# EAGLE design 40106PWM (EAGLE 6.3)
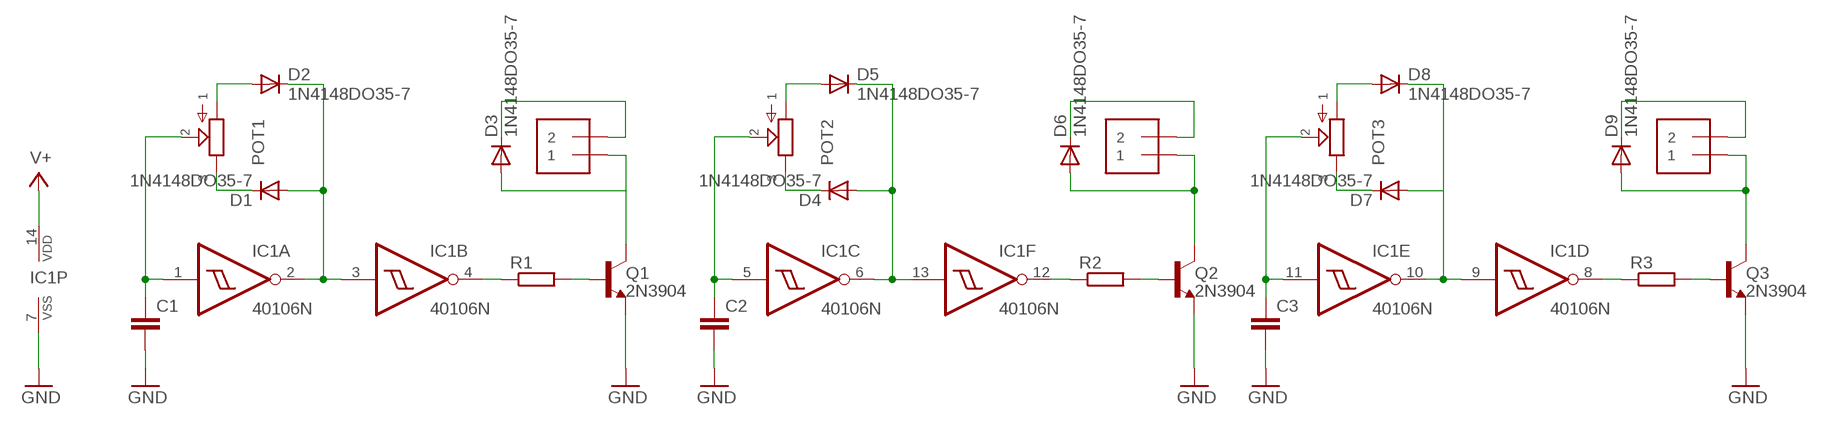
[diagram p0: schematic, sheet 1]

## Parts
C1  C-EU050-025X075  [C050-025X075]
C2  C-EU050-025X075  [C050-025X075]
C3  C-EU050-025X075  [C050-025X075]
D1  1N4148DO35-7  [DO35-7]
D2  1N4148DO35-7  [DO35-7]
D3  1N4148DO35-7  [DO35-7]
D4  1N4148DO35-7  [DO35-7]
D5  1N4148DO35-7  [DO35-7]
D6  1N4148DO35-7  [DO35-7]
D7  1N4148DO35-7  [DO35-7]
D8  1N4148DO35-7  [DO35-7]
D9  1N4148DO35-7  [DO35-7]
IC1  40106N  [DIL14]
J1  1X2-3.5MM  [1X2-3.5MM]
J2  1X2-3.5MM  [1X2-3.5MM]
J3  1X2-3.5MM  [1X2-3.5MM]
POT1  POT-EU16MM  [16MM]
POT2  POT-EU16MM  [16MM]
POT3  POT-EU16MM  [16MM]
Q1  2N3904  [TO92-]
Q2  2N3904  [TO92-]
Q3  2N3904  [TO92-]
R1  R-EU_0207/10  [0207/10]
R2  R-EU_0207/10  [0207/10]
R3  R-EU_0207/10  [0207/10]

## Nets
GND: C1.2 C2.2 C3.2 IC1.7(P:VSS) Q1.3(E) Q2.3(E) Q3.3(E)
N$1: D1.A D2.C IC1.2(A:O) IC1.3(B:I)
N$2: D4.A D5.C IC1.6(C:O) IC1.13(F:I)
N$3: D7.A D8.C IC1.9(D:I) IC1.10(E:O)
N$4: D2.A POT1.1
N$5: C3.1 IC1.11(E:I) POT3.2
N$6: C1.1 IC1.1(A:I) POT1.2
N$7: C2.1 IC1.5(C:I) POT2.2
N$8: D1.C POT1.3
N$9: IC1.4(B:O) R1.1
N$10: Q1.2(B) R1.2
N$11: D3.A J1.1 Q1.1(C)
N$12: D3.C J1.2
N$15: D5.A POT2.1
N$16: D4.C POT2.3
N$17: IC1.12(F:O) R2.1
N$18: Q2.2(B) R2.2
N$19: D6.A J2.1 Q2.1(C)
N$20: D6.C J2.2
N$23: D8.A POT3.1
N$24: D7.C POT3.3
N$25: IC1.8(D:O) R3.1
N$26: Q3.2(B) R3.2
N$27: D9.A J3.1 Q3.1(C)
N$28: D9.C J3.2
V+: IC1.14(P:VDD)

## Library data of the parts
C1-C3 = rcl:C-EU: CAPACITOR, European symbol
D1-D9 = diode:1N4148: DIODE high speed (Philips)
IC1 = 40xx:40106: Hex SCHMITT TRIGGER
J1-J3 = adafruit:1X2: 3.5mm Terminal block http://www.ladyada.net/library/pcb/eaglelibrary.html
POT1-POT3 = gm-pots:POT-EU
Q1-Q3 = gm-trans:2N3904: NPN Transistor
R1-R3 = rcl:R-EU_: RESISTOR, European symbol

## Board
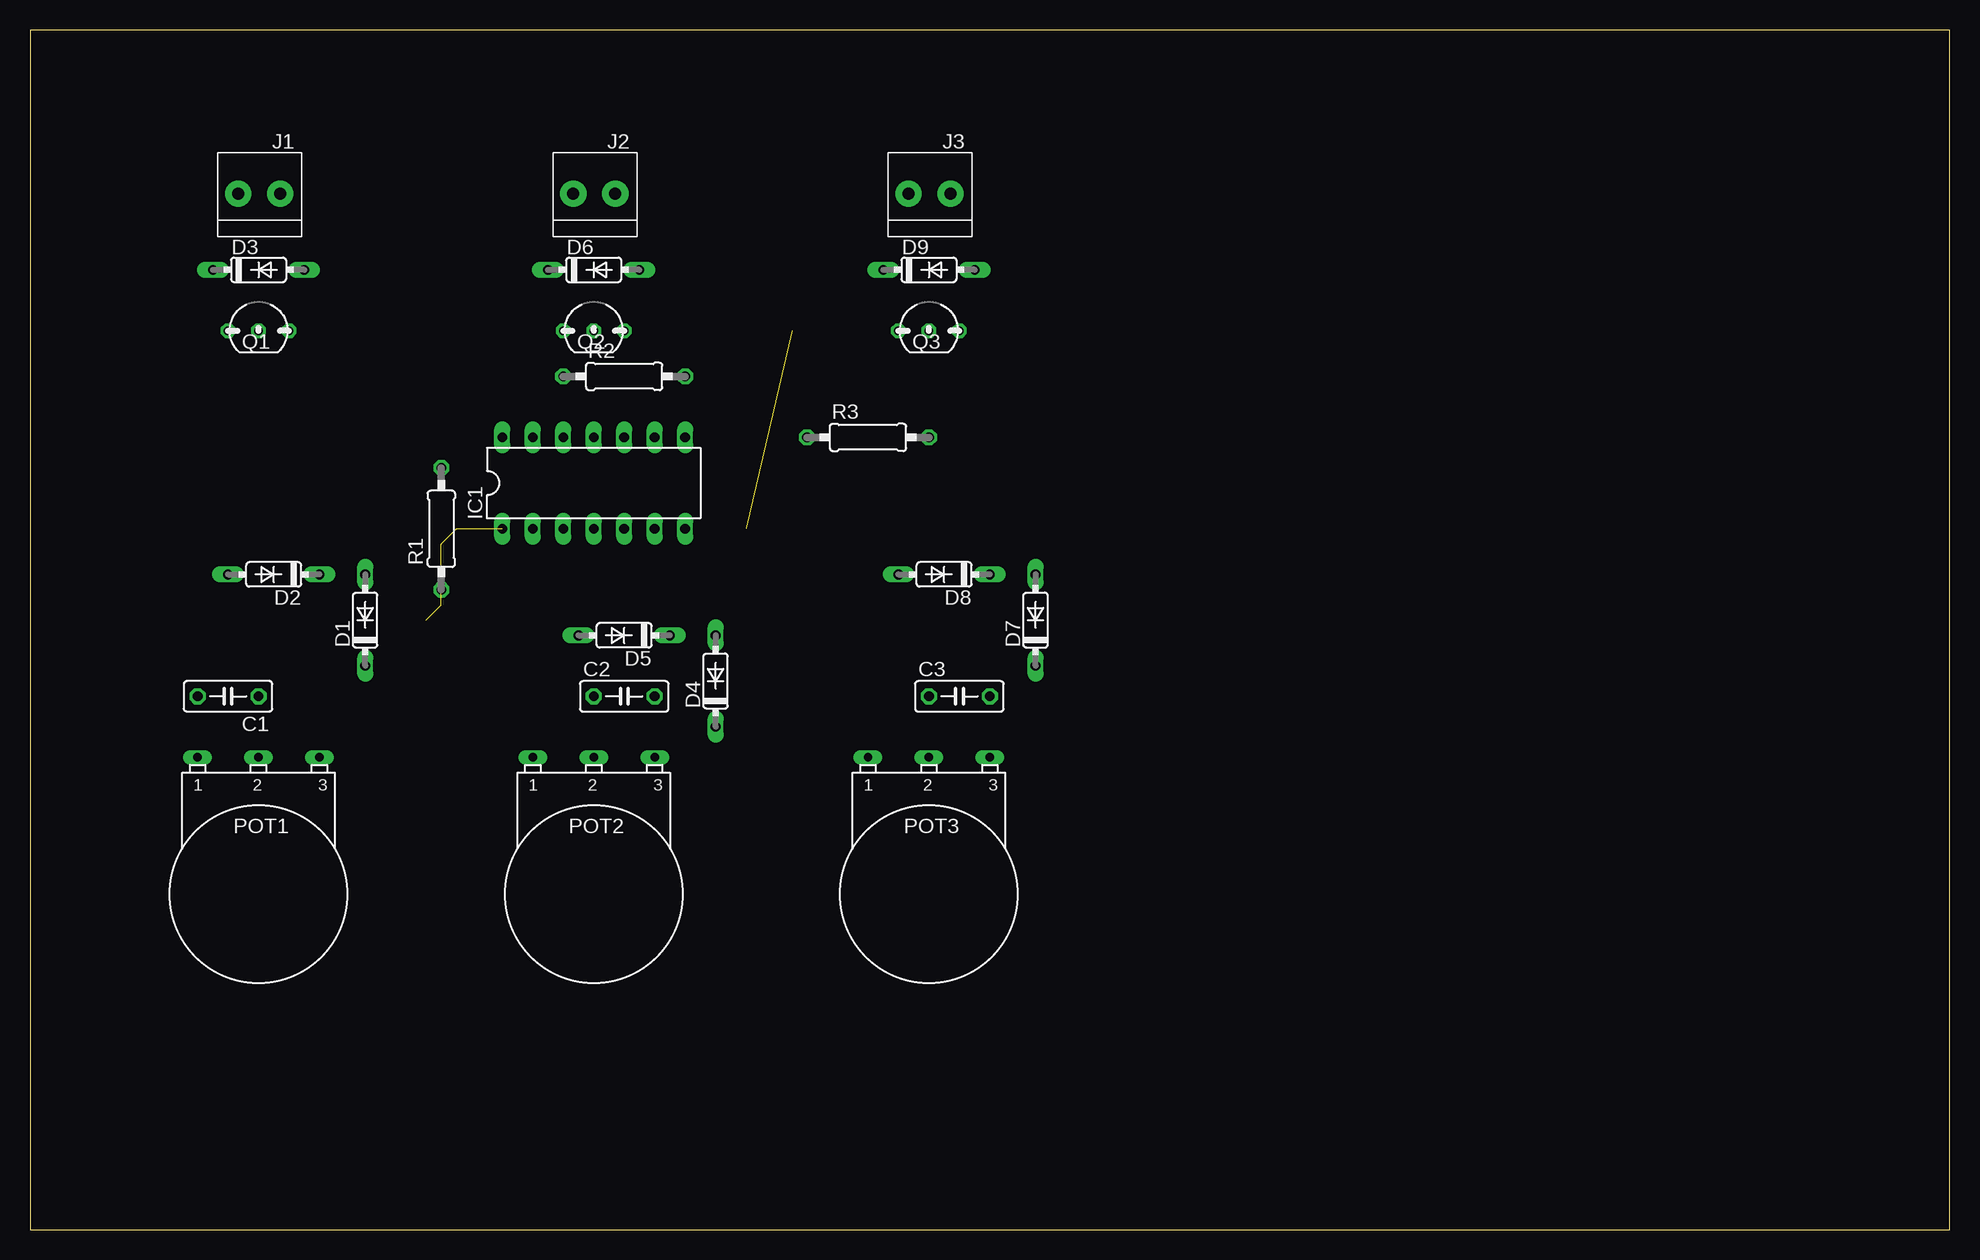
[diagram p1: board, top side]
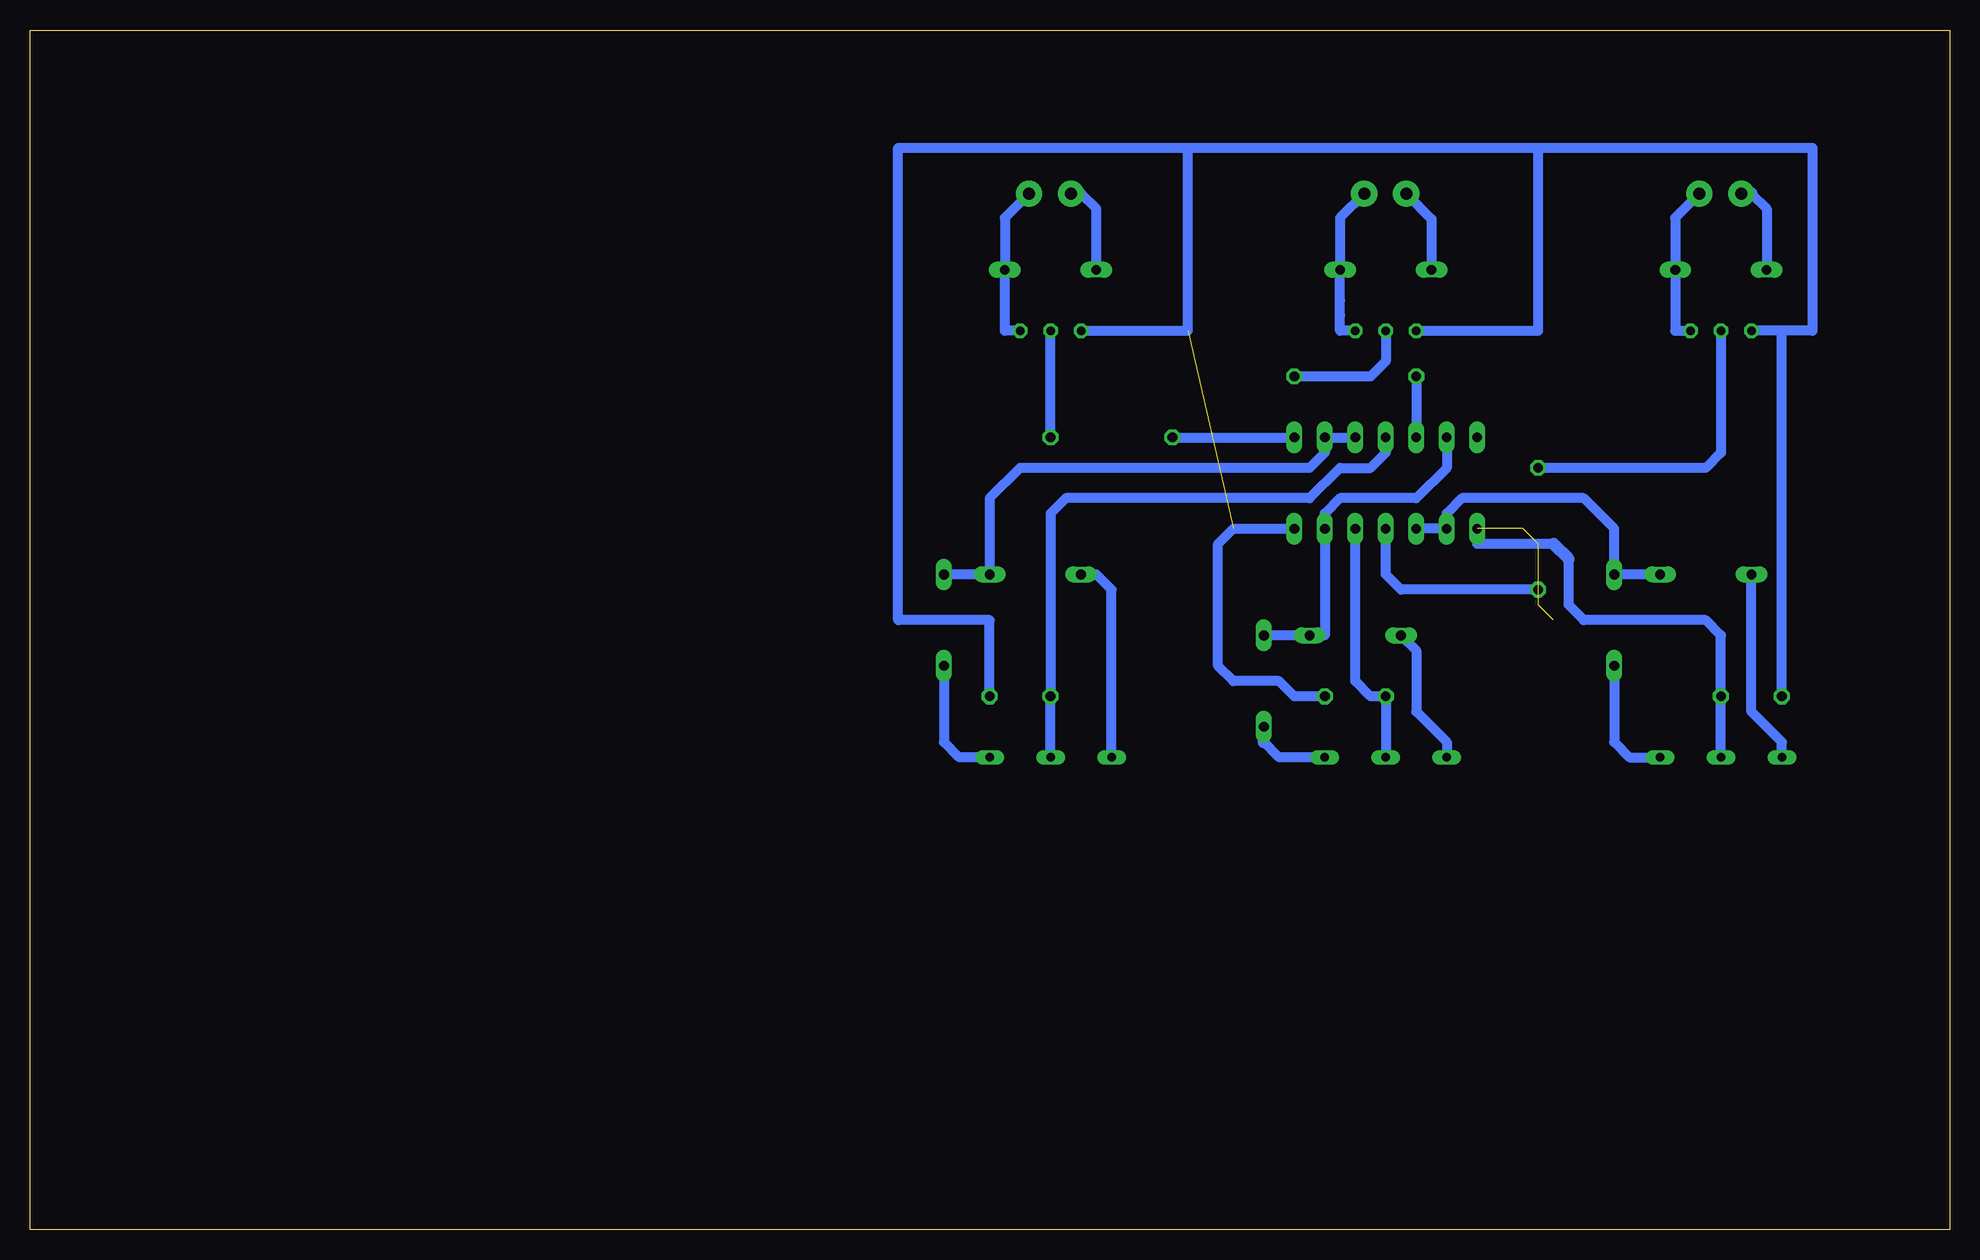
[diagram p2: board, bottom side, seen from below]

Size 160 x 100 mm. Coordinates in mm from the lower left corner, seen from the top.
Outline: 0,0 160,0 160,100 0,100 0,0
Copper layers (1*16): Top 0.035mm / dielectric 1.5mm / Bottom 0.035mm
Design rules "default *": minimum track width 15mil, minimum drill 24mil, track to track 10mil, track to pad 10mil, pad to pad 10mil, via to via 8mil, smd to smd 8mil, copper to edge 40mil, drill to drill 8mil, minimum pad ring 10mil, minimum via ring 8mil, stop-mask expansion 20mil, vias tented up to drill 0mil, thermal gap 10mil

### Footprints (pad centres in the part's own frame; a part is rotated, then mirrored left to right if it is on the bottom)
C050-025X075 = drill 0.813 octagon: 1 -2.54,0; 2 2.54,0
DO35-7 = drill 0.813 long: A 3.81,0; C -3.81,0
DIL14 = drill 0.813 long: 1 -7.62,-3.81; 2 -5.08,-3.81; 3 -2.54,-3.81; 4 0,-3.81; 5 2.54,-3.81; 6 5.08,-3.81; 7 7.62,-3.81; 8 7.62,3.81; 9 5.08,3.81; 10 2.54,3.81; 11 0,3.81; 12 -2.54,3.81; 13 -5.08,3.81; 14 -7.62,3.81
1X2-3.5MM = drill 1 pad 2.184: 1 1.8,0; 2 -1.7,0
16MM = drill 0.7 long: 1 5.08,0; 2 0,0; 3 -5.08,0
TO92- = drill 0.7 octagon: 1 2.54,0; 2 0,0; 3 -2.54,0
0207/10 = drill 0.813 octagon: 1 -5.08,0; 2 5.08,0

### Placement (x,y rotation side)
C1  16.51,44.45 180 top
C2  49.53,44.45 0 top
C3  77.47,44.45 0 top
D1  27.94,50.8 90 top
D2  20.32,54.61 180 top
D3  19.05,80.01 0 top
D4  57.15,45.72 90 top
D5  49.53,49.53 180 top
D6  46.99,80.01 0 top
D7  83.82,50.8 90 top
D8  76.2,54.61 180 top
D9  74.93,80.01 0 top
IC1  46.99,62.23 0 top
J1  19.05,86.36 0 top
J2  46.99,86.36 0 top
J3  74.93,86.36 0 top
POT1  19.05,39.37 180 top
POT2  46.99,39.37 180 top
POT3  74.93,39.37 180 top
Q1  19.05,74.93 0 top
Q2  46.99,74.93 0 top
Q3  74.93,74.93 0 top
R1  34.29,58.42 90 top
R2  49.53,71.12 0 top
R3  69.85,66.04 0 top

### Tracks (layer width: path | path; a pad name or v marks a point on that pad's centre or on a via)
GND  (1 unrouted)
  Bottom 0.813: C1.2 13.97,74.93 | C2.2 54.61,44.45 55.88,45.72 59.69,45.72 60.96,46.99 60.96,57.15 59.69,58.42 IC1.7 | Q2.3 34.29,74.93 34.29,90.17 | 34.29,90.17 11.43,90.17 11.43,74.93 13.97,74.93 | 13.97,74.93 Q1.3 | Q3.3 63.5,74.93 63.5,90.17 | 63.5,90.17 34.29,90.17 | C3.2 80.01,50.8 87.63,50.8 87.63,90.17 63.5,90.17
N$1
  Bottom 0.813: D2.C D1.A 27.94,58.42 30.48,60.96 40.64,60.96 41.91,59.69 IC1.2 IC1.3
N$2
  Bottom 0.813: D4.A D5.C 52.07,49.53 IC1.6 52.07,59.69 50.8,60.96 44.45,60.96 41.91,63.5 IC1.13
N$3
  Bottom 0.813: D7.A D8.C 80.01,60.96 77.47,63.5 53.34,63.5 52.07,64.77 IC1.9 IC1.10
N$4
  Bottom 0.813: POT1.1 13.97,40.64 16.51,43.18 D2.A
N$5
  Bottom 0.813: POT3.2 C3.1 74.93,59.69 73.66,60.96 53.34,60.96 50.8,63.5 48.26,63.5 46.99,64.77 IC1.11
N$6  (4 unrouted)
  Bottom 0.813: POT1.2 C1.1 19.05,49.53 20.32,50.8 30.48,50.8 31.75,52.07 31.75,55.88 | 33.02,57.15 39.37,57.15 IC1.1
  Bottom 1.016: 31.75,55.88 33.02,57.15
N$7
  Bottom 0.813: POT2.2 C2.1 48.26,44.45 49.53,45.72 IC1.5
N$8
  Bottom 0.813: D1.C 27.94,40.64 26.67,39.37 POT1.3
N$9
  Bottom 0.813: R1.1 45.72,53.34 46.99,54.61 IC1.4
N$10
  Bottom 0.813: Q1.2 19.05,64.77 20.32,63.5 R1.2
N$11
  Bottom 0.813: J1.1 22.86,84.35 D3.A 22.86,74.93 Q1.1
N$12
  Bottom 0.813: 16.51,86.36 15.24,85.09 D3.C
  Bottom 1.016: J1.2 16.51,86.36
N$15
  Bottom 0.813: D5.A 44.45,48.26 44.45,43.18 41.91,40.64 POT2.1
N$16
  Bottom 0.813: POT2.3 55.88,39.37 57.15,40.64
  Bottom 1.016: 57.15,40.64 D4.C
N$17
  Bottom 0.813: R2.1 IC1.12
N$18
  Bottom 0.813: Q2.2 46.99,72.39 48.26,71.12 R2.2
N$19
  Bottom 0.813: J2.1 50.8,84.35 D6.A 50.8,77.47 50.8,76.2 50.8,74.93 Q2.1
N$20
  Bottom 0.813: J2.2 43.18,84.25 D6.C
N$23
  Bottom 0.813: POT3.1 69.85,53.34 71.12,54.61 D8.A
N$24
  Bottom 0.813: D7.C 83.82,40.64 82.55,39.37 POT3.3
N$25
  Bottom 0.813: R3.1 IC1.8
N$26
  Bottom 0.813: R3.2 Q3.2
N$27
  Bottom 0.813: J3.1 78.74,84.35 D9.A 78.74,74.93 Q3.1
N$28
  Bottom 0.813: D9.C 71.12,85.09 72.39,86.36 J3.2